# Altium schematic sheet 06_ZYNQ_PL.SchDoc
size A3; SheetNumber: 6; SheetTotal: 9
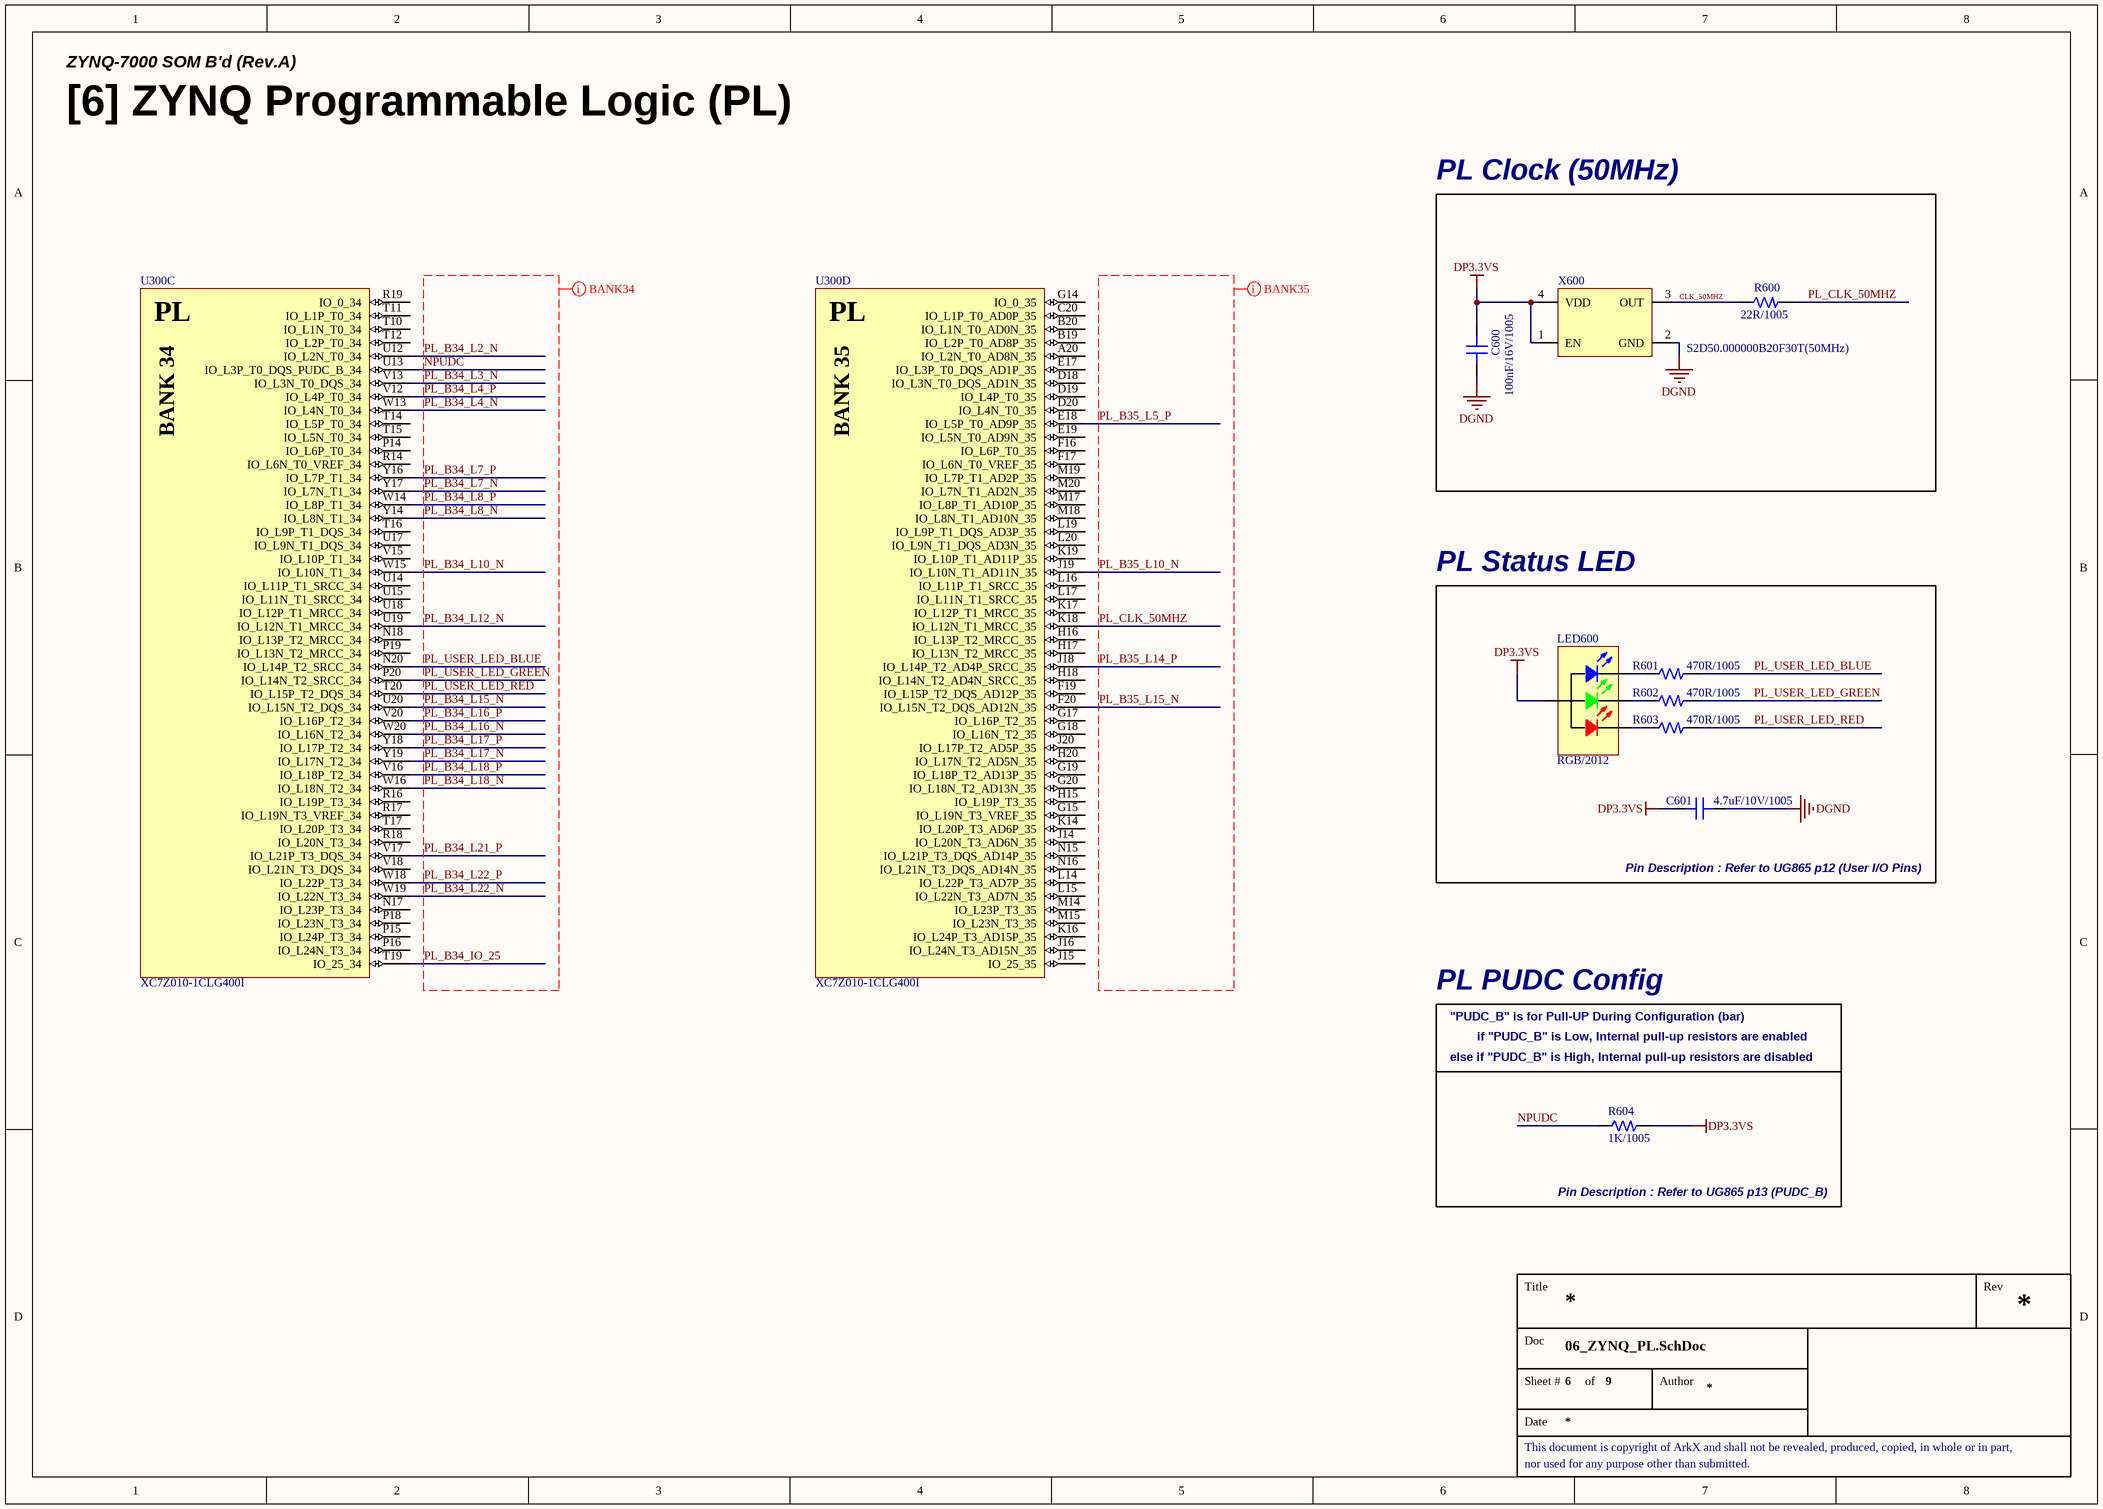
[diagram p0: 06_ZYNQ_PL.SchDoc]

## Parts
C600  100nF/16V/1005  [CAP 1005 (0402_INCH)]
C601  4.7uF/10V/1005  [CAP 1005 (0402_INCH)]
LED600  RGB/2012  [LED MHT170RGBCT]
R600  22R/1005  [RES 1005 (0402_inch)]
R601  470R/1005  [RES 1005 (0402_inch)]
R602  470R/1005  [RES 1005 (0402_inch)]
R603  470R/1005  [RES 1005 (0402_inch)]
R604  1K/1005  [RES 1005 (0402_inch)]
U300  XC7Z010-1CLG400I  [IC_SOC_XC7Z010-1CLG400I]  (parts C,D of 9)
X600  S2D50.000000B20F30T(50MHz)  [OSC SMD_2.5x2.0 (SCTF)]

## Blocks framed on the sheet
PL Clock (50MHz): C600 R600 X600
PL Status LED: C601 LED600 R601-R603
PL PUDC Config: R604

## Nets
DGND: C600.2 C601.1 X600.2(GND)
DP3.3VS: C600.1 C601.2 LED600.4(Common_Anode) R604.2 X600.1(EN) X600.4(VDD)
CLK_50MHZ: R600.1 X600.3(OUT)
NPUDC: R604.1 U300.U13(IO_L3P_T0_DQS_PUDC_B_34)
PL_B34_IO_25: U300.T19(IO_25_34)
PL_B34_L2_N: U300.U12(IO_L2N_T0_34)
PL_B34_L3_N: U300.V13(IO_L3N_T0_DQS_34)
PL_B34_L4_N: U300.W13(IO_L4N_T0_34)
PL_B34_L4_P: U300.V12(IO_L4P_T0_34)
PL_B34_L7_N: U300.Y17(IO_L7N_T1_34)
PL_B34_L7_P: U300.Y16(IO_L7P_T1_34)
PL_B34_L8_N: U300.Y14(IO_L8N_T1_34)
PL_B34_L8_P: U300.W14(IO_L8P_T1_34)
PL_B34_L10_N: U300.W15(IO_L10N_T1_34)
PL_B34_L12_N: U300.U19(IO_L12N_T1_MRCC_34)
PL_B34_L15_N: U300.U20(IO_L15N_T2_DQS_34)
PL_B34_L16_N: U300.W20(IO_L16N_T2_34)
PL_B34_L16_P: U300.V20(IO_L16P_T2_34)
PL_B34_L17_N: U300.Y19(IO_L17N_T2_34)
PL_B34_L17_P: U300.Y18(IO_L17P_T2_34)
PL_B34_L18_N: U300.W16(IO_L18N_T2_34)
PL_B34_L18_P: U300.V16(IO_L18P_T2_34)
PL_B34_L21_P: U300.V17(IO_L21P_T3_DQS_34)
PL_B34_L22_N: U300.W19(IO_L22N_T3_34)
PL_B34_L22_P: U300.W18(IO_L22P_T3_34)
PL_B35_L5_P: U300.E18(IO_L5P_T0_AD9P_35)
PL_B35_L10_N: U300.J19(IO_L10N_T1_AD11N_35)
PL_B35_L14_P: U300.J18(IO_L14P_T2_AD4P_SRCC_35)
PL_B35_L15_N: U300.F20(IO_L15N_T2_DQS_AD12N_35)
PL_CLK_50MHZ: R600.2 U300.K18(IO_L12N_T1_MRCC_35)
PL_USER_LED_BLUE: R601.2 U300.N20(IO_L14P_T2_SRCC_34)
PL_USER_LED_GREEN: R602.2 U300.P20(IO_L14N_T2_SRCC_34)
PL_USER_LED_RED: R603.2 U300.T20(IO_L15P_T2_DQS_34)
NetLED600_1: LED600.1(RED) R603.1
NetLED600_2: LED600.2(GREEN) R602.1
NetLED600_3: LED600.3(BLUE) R601.1

Not connected (* = marked no-connect by the designer): U300 A20(IO_L2N_T0_AD8N_35) B19(IO_L2P_T0_AD8P_35) B20(IO_L1N_T0_AD0N_35) C20(IO_L1P_T0_AD0P_35) D18(IO_L3N_T0_DQS_AD1N_35) D19(IO_L4P_T0_35) D20(IO_L4N_T0_35) E17(IO_L3P_T0_DQS_AD1P_35) E19(IO_L5N_T0_AD9N_35) F16(IO_L6P_T0_35) F17(IO_L6N_T0_VREF_35) F19(IO_L15P_T2_DQS_AD12P_35) G14(IO_0_35) G15(IO_L19N_T3_VREF_35) G17(IO_L16P_T2_35) G18(IO_L16N_T2_35) G19(IO_L18P_T2_AD13P_35) G20(IO_L18N_T2_AD13N_35) H15(IO_L19P_T3_35) H16(IO_L13P_T2_MRCC_35) H17(IO_L13N_T2_MRCC_35) H18(IO_L14N_T2_AD4N_SRCC_35) H20(IO_L17N_T2_AD5N_35) J14(IO_L20N_T3_AD6N_35) J15(IO_25_35) J16(IO_L24N_T3_AD15N_35) J20(IO_L17P_T2_AD5P_35) K14(IO_L20P_T3_AD6P_35) K16(IO_L24P_T3_AD15P_35) K17(IO_L12P_T1_MRCC_35) K19(IO_L10P_T1_AD11P_35) L14(IO_L22P_T3_AD7P_35) L15(IO_L22N_T3_AD7N_35) L16(IO_L11P_T1_SRCC_35) L17(IO_L11N_T1_SRCC_35) L19(IO_L9P_T1_DQS_AD3P_35) L20(IO_L9N_T1_DQS_AD3N_35) M14(IO_L23P_T3_35) M15(IO_L23N_T3_35) M17(IO_L8P_T1_AD10P_35) M18(IO_L8N_T1_AD10N_35) M19(IO_L7P_T1_AD2P_35) M20(IO_L7N_T1_AD2N_35) N15(IO_L21P_T3_DQS_AD14P_35) N16(IO_L21N_T3_DQS_AD14N_35) N17(IO_L23P_T3_34) N18(IO_L13P_T2_MRCC_34) P14(IO_L6P_T0_34) P15(IO_L24P_T3_34) P16(IO_L24N_T3_34) P18(IO_L23N_T3_34) P19(IO_L13N_T2_MRCC_34) R14(IO_L6N_T0_VREF_34) R16(IO_L19P_T3_34) R17(IO_L19N_T3_VREF_34) R18(IO_L20N_T3_34) R19(IO_0_34) T10(IO_L1N_T0_34) T11(IO_L1P_T0_34) T12(IO_L2P_T0_34) T14(IO_L5P_T0_34) T15(IO_L5N_T0_34) T16(IO_L9P_T1_DQS_34) T17(IO_L20P_T3_34) U14(IO_L11P_T1_SRCC_34) U15(IO_L11N_T1_SRCC_34) U17(IO_L9N_T1_DQS_34) U18(IO_L12P_T1_MRCC_34) V15(IO_L10P_T1_34) V18(IO_L21N_T3_DQS_34)

## Layout directives
net class PL_B34: NPUDC, PL_B34_IO_25, PL_B34_L2_N, PL_B34_L3_N, PL_B34_L4_N, PL_B34_L4_P, PL_B34_L7_N, PL_B34_L7_P, PL_B34_L8_N, PL_B34_L8_P, PL_B34_L10_N, PL_B34_L12_N, PL_B34_L15_N, PL_B34_L16_N, PL_B34_L16_P, PL_B34_L17_N, PL_B34_L17_P, PL_B34_L18_N, PL_B34_L18_P, PL_B34_L21_P, PL_B34_L22_N, PL_B34_L22_P, PL_USER_LED_BLUE, PL_USER_LED_GREEN, PL_USER_LED_RED
net class PL_B35: PL_B35_L5_P, PL_B35_L10_N, PL_B35_L14_P, PL_B35_L15_N, PL_CLK_50MHZ

## Notes on the sheet
- ZYNQ-7000 SOM B'd (Rev.A)
- [6] ZYNQ Programmable Logic (PL)
- Pin Description : Refer to UG865 p12 (User I/O Pins)
- "PUDC_B" is for Pull-UP During Configuration (bar)
- if "PUDC_B" is Low, Internal pull-up resistors are enabled
- else if "PUDC_B" is High, Internal pull-up resistors are disabled
- Pin Description : Refer to UG865 p13 (PUDC_B)
- Title
- Rev
- Doc
- Sheet #
- of
- Author
- This document is copyright of ArkX and shall not be revealed, produced, copied, in whole or in part,
- Date
- nor used for any purpose other than submitted.
- (in symbol IC_SOC_XC7Z010-1CLG400I, part C) PL; BANK 34
- (in symbol IC_SOC_XC7Z010-1CLG400I, part D) PL; BANK 35

## Library data of the parts
C600 = CAP_100nF/16V/1005: Ceramic CAP_100nF/16V/1005; LCSC Part #: C1525; JLCPCB Part Type: Basic Part
C601 = CAP_4.7uF/10V/1005: 10V 4.7uF X5R ±20% 0402  Multilayer Ceramic Capacitors MLCC - SMD/SMT ROHS; JLCPCB Part Type: Basic Part; LCSC Part #: C23733
LED600 = LED_RGB_MHT170RGBCT: Colorless transparence -30℃~+85℃ Positive post Common anode RGB 120° 0805  Light Emitting Diodes (LED) ROHS; LCSC Part #: C2962094; JLCPCB Part Type: Extended Part
R600 = RES_22R/1005/62.5mW: Value: 22R; Power Rating: 62.5mW; Precision: 1%; Size: 1005; LCSC Part #: C25092; JLCPCB Part Type: Basic Part
R601-R603 = RES_470R/1005/62.5mW: Value: 470R; Power Rating: 62.5mW; Precision: 1%; Size: 1005; LCSC Part #: C25117; JLCPCB Part Type: Basic Part
R604 = RES_1K/1005/62.5mW: Value: 1K; Power Rating: 62.5mW; Precision: 1%; Size: 1005; LCSC Part #: C11702; JLCPCB Part Type: Basic Part
U300 = IC_SOC_XC7Z010-1CLG400I: Dual ARM® Cortex®-A9 MPCore™ with CoreSight™ System On Chip (SOC) IC Zynq®-7000 Artix™-7 FPGA, 28K Logic Cells 766MHz 400-CSPBGA (17x17); LCSC Part #: C2840994; JLCPCB Part Type: Extended Part
X600 = OSC_S2D50.000000B20F30T(50MHz): 3.3V 20mA ±30ppm CMOS 50MHz SMD2520-4P  Oscillators ROHS; LCSC Part #: C907626; JLCPCB Part Type: Extended Part